# Altium schematic sheet DC.SchDoc
size A
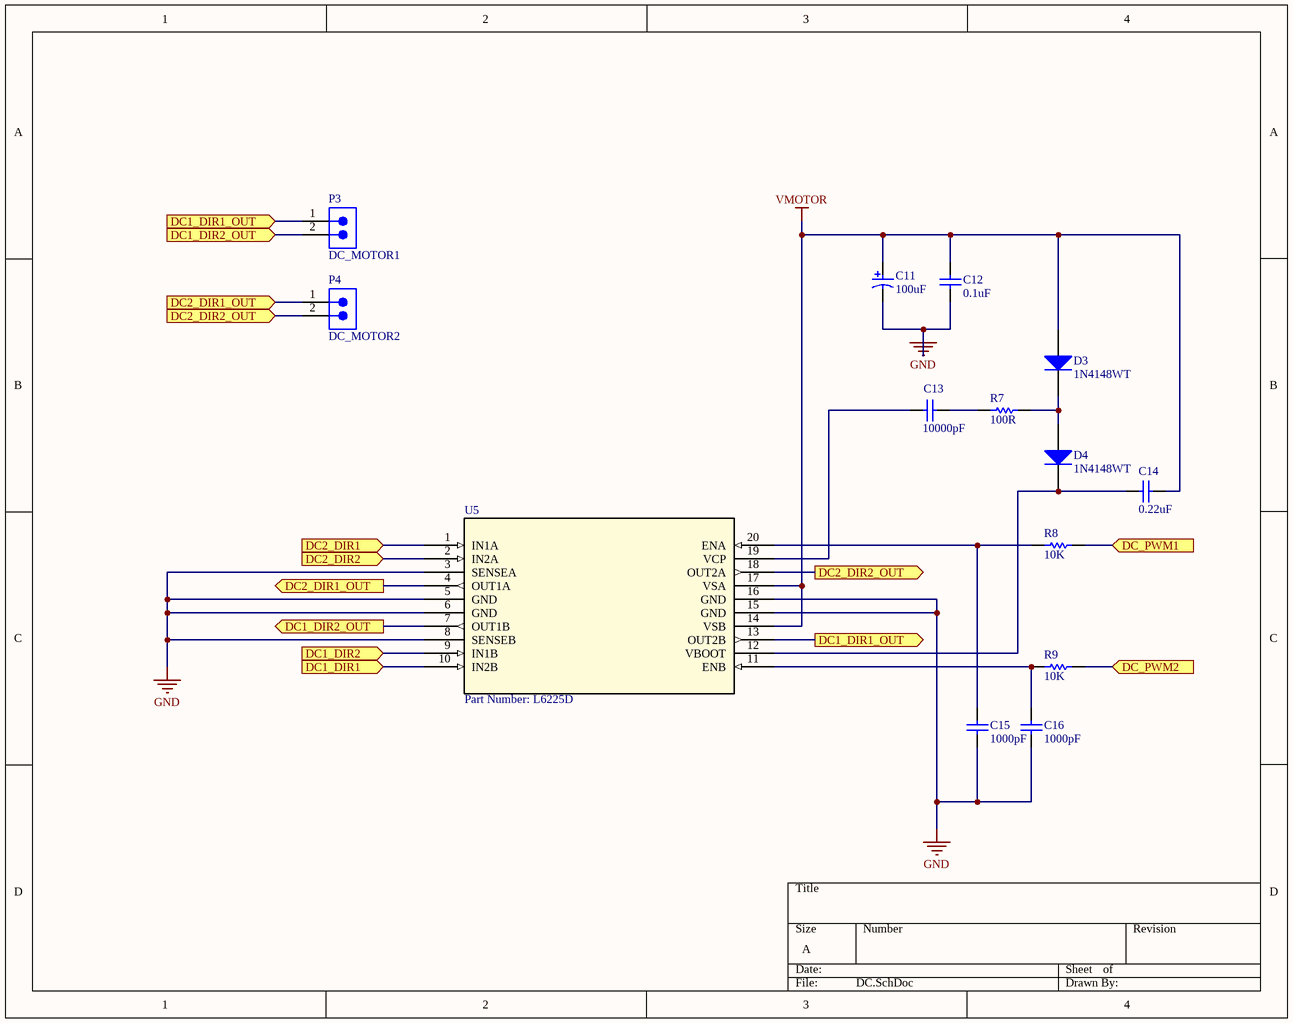
[diagram p0: DC.SchDoc]

## Parts
C11  100uF  [NIC-CAPA2-6.3X5.8_V]
C12  0.1uF  [CAPC1608X90X35LL15T15]
C13  10000pF  [CAPC1608X90X35LL15T15]
C14  0.22uF  [CAPC1608X90X35ML10T15]
C15  1000pF  [CAPC2013X140X50NL20T25]
C16  1000pF  [CAPC2013X140X50NL20T25]
D3  1N4148WT  [FAIR-SOD-523F-2_V]
D4  1N4148WT  [FAIR-SOD-523F-2_V]
P3  DC_MOTOR1  [SMTC-DW-02-16-X-S-200]
P4  DC_MOTOR2  [SMTC-DW-02-16-X-S-200]
R7  100R  [RESC1609X50X30ML10T20]
R8  10K  [RESC1609X50X30ML10T20]
R9  10K  [RESC1609X50X30ML10T20]
U5  Part Number: L6225D  [SO-20]

## Ports
DC1_DIR1 (in), DC1_DIR1_OUT (in), DC1_DIR1_OUT (out), DC1_DIR2 (in), DC1_DIR2_OUT (in), DC1_DIR2_OUT (out), DC2_DIR1 (in), DC2_DIR1_OUT (in), DC2_DIR1_OUT (out), DC2_DIR2 (in), DC2_DIR2_OUT (in), DC2_DIR2_OUT (out), DC_PWM1 (in), DC_PWM2 (in)

## Nets
GND: C11.2 C12.1 C15.1 C16.1 U5.3(SENSEA) U5.5(GND) U5.6(GND) U5.8(SENSEB) U5.15(GND) U5.16(GND)
VMOTOR: C11.1 C12.2 C14.2 D3.2(A) U5.14(VSB) U5.17(VSA)
DC1_DIR1: U5.10(IN2B) ; port DC1_DIR1
DC1_DIR1_OUT: P3.1 U5.13(OUT2B) ; port DC1_DIR1_OUT
DC1_DIR2: U5.9(IN1B) ; port DC1_DIR2
DC1_DIR2_OUT: P3.2 U5.7(OUT1B) ; port DC1_DIR2_OUT
DC2_DIR1: U5.1(IN1A) ; port DC2_DIR1
DC2_DIR1_OUT: P4.1 U5.4(OUT1A) ; port DC2_DIR1_OUT
DC2_DIR2: U5.2(IN2A) ; port DC2_DIR2
DC2_DIR2_OUT: P4.2 U5.18(OUT2A) ; port DC2_DIR2_OUT
DC_PWM1: R8.1 ; port DC_PWM1
DC_PWM2: R9.1 ; port DC_PWM2
NetC13_1: C13.1 U5.19(VCP)
NetC13_2: C13.2 R7.1
NetC14_1: C14.1 D4.1(K) U5.12(VBOOT)
NetC15_2: C15.2 R8.2 U5.20(ENA)
NetC16_2: C16.2 R9.2 U5.11(ENB)
NetD3_1: D3.1(K) D4.2(A) R7.2

## Library data of the parts
C11 = CMP-0687-00050-1: Aluminum Electrolytic Capacitor, UD Series, Low Impedance, 100 uF, 16 V, + / - 20%, -55 to 105 degC, Chip Type, 6.3 x 5.8 mm D x L, Pb-Free, Reel; PartNumber: UUD1C101MCL1GS; Manufacturer: Nichicon; Tolerance Rated Capacitance: -20 to 20%; Impedance: 0.44 Ohm; Rated Voltage: 16 V; Endurance Time: 2000 h; Packing: Dia382mm Reel; Rated Ripple Current (at 100kHz): 230 mA; PackageReference: CAPAE-D6.3H5.8; ComponentLink2URL: http://products.nichicon.co.jp/en/pdf/XJA043/e-ud.pdf; ComponentLink3Description: Package Specification; Mounting Technology: Surface Mount; Rated Capacitance: 100 uF; RoHS: TRUE; Diameter: 6.3 mm; Length: 5.8 mm; ComponentLink3URL: http://products.nichicon.co.jp/en/pdf/XJA043/e-ud.pdf; ComponentLink1Description: Manufacturer URL; ComponentLink2Description: Datasheet; PackageDescription: 2-Pin Surface Mount Device, Diameter 6.3 mm, Height 5.8 mm, Pitch 5.4 mm; DatasheetVersion: 08/2012; ComponentLink1URL: http://www.nichicon.co.jp/
C12 = CMP-2006-04389-2: Chip Capacitor, 100 nF, +/- 10%, 50 V, -55 to 125 degC, 0603 (1608 Metric), RoHS, Tape and Reel; Case\Package: 0603; Type (Capacitors): X7R; Capacitance: 100 nF; Voltage Rating: 50 V; Pins: 2; Max Operating Temperature: 125 degC; Min Operating Temperature: -55 degC; Case Code (Imperial): 0603; DatasheetVersion: 07/2016; Package Quantity: 4000; Length: 1.6 mm; REACH SVHC: No SVHC; Packaging: Tape and Reel; Case Code (Metric): 1608; Mounting Technology: Surface Mount; RoHSCompliant: true; Height: 0.9 mm; ComponentLink1URL: http://www.avx.com/; ComponentLink2URL: http://datasheets.avx.com/X7RDielectric.pdf; Mount: Surface Mount; ComponentLink2Description: Datasheet; Width: 0.81 mm; PackageReference: 0603; PackageDescription: 2-Pin Surface Mount Device, Body 1.6 x 0.81 mm; Radiation Hardening: No; ComponentLink1Description: Manufacturer URL; Voltage Rating (DC): 50 V; Tolerance: 10%
C13 = CMP-2006-04374-1: Manufacturer: AVX Interconnect / Elco; Part Number: 06035C-103KAT2A
C14 = CMP-2006-02784-1: Manufacturer: Murata; Part Number: GRM188F51H224ZA01D
C15 C16 = CMP-2007-04527-1: Manufacturer: AVX Interconnect / Elco; Part Number: 08051A102JAT2A
D3 D4 = CMP-0881-00001-1: High Conductance Fast Switching Diode, 75 V, -55 to 150 degC, 2-Pin SOD523F, RoHS; Manufacturer: Fairchild Semiconductor; IR (VR: 75 V)=5 uA Max.; VF: 1 V Max.; BVR (IR: 5 uA)=75 V Min.; CO: 4 pF Max.; DatasheetVersion: Rev. A2; ComponentLink1Description: Manufacturer URL; PackageDescription: 2-Pin Surface Mount Device, Body 1.2 x 0.8 mm, Height 0.7 mm; ComponentLink2URL: http://www.fairchildsemi.com/ds/1N/1N4148WT.pdf; ComponentLink2Description: Datasheet; PartNumber: 1N4148WT; ComponentLink1URL: http://www.fairchildsemi.com/; Temperature Range: -55 to 150 degC; Mounting Technology: Surface Mount; PackageReference: SOD-523F-2; RoHS: TRUE
P3 P4 = CMP-1024-00001-1: Flexible .025" SQ Board Stacker, Through-hole, Vertical, -55 to 125 degC, 2.54 mm Pitch, 2-Pin, Male, RoHS; PartNumber: DW-02-16-G-S-200; Manufacturer: Samtec; Pitch: 2.54 mm; ComponentLink1Description: Manufacturer URL; ComponentLink3Description: Package Specification; DatasheetVersion: F-214; ComponentLink1URL: http://www.samtec.com; RoHS: True; PackageVersion: AX, 8/1984; ComponentLink2URL: http://www.samtec.com/documents/webfiles/pdf/DW.PDF; ComponentLink2Description: Datasheet; Orientation: Vertical; PackageReference: DW-02-16-X-S-200; PackageDescription: Low Cost Board Spacer; ComponentLink3URL: http://www.samtec.com/documents/webfiles/cpdf/XW-XX-XX-XXX-X-XXXX-XXX-XX-XXX-MKT1.PDF; Mounting Technology: Through-hole; Temperature Range: -55 to 125 degC
R7 = CMP-2000-03827-1: Part Number: CRCW0603100RJNEA; Manufacturer: Vishay Dale
R8 R9 = CMP-2000-03838-1: Manufacturer: Vishay Dale; Part Number: CRCW060310K0JNEA
U5 = L6225D: No Description Available; Vendor: STMicroelectronics; Built_By: EMA_UL_Team; Manufacturer_Part_Number: L6225D; Copyright: Copyright (C) 2018 Accelerated Designs. All rights reserved; RefDes: RefDes; Type: DEV; Value: Value